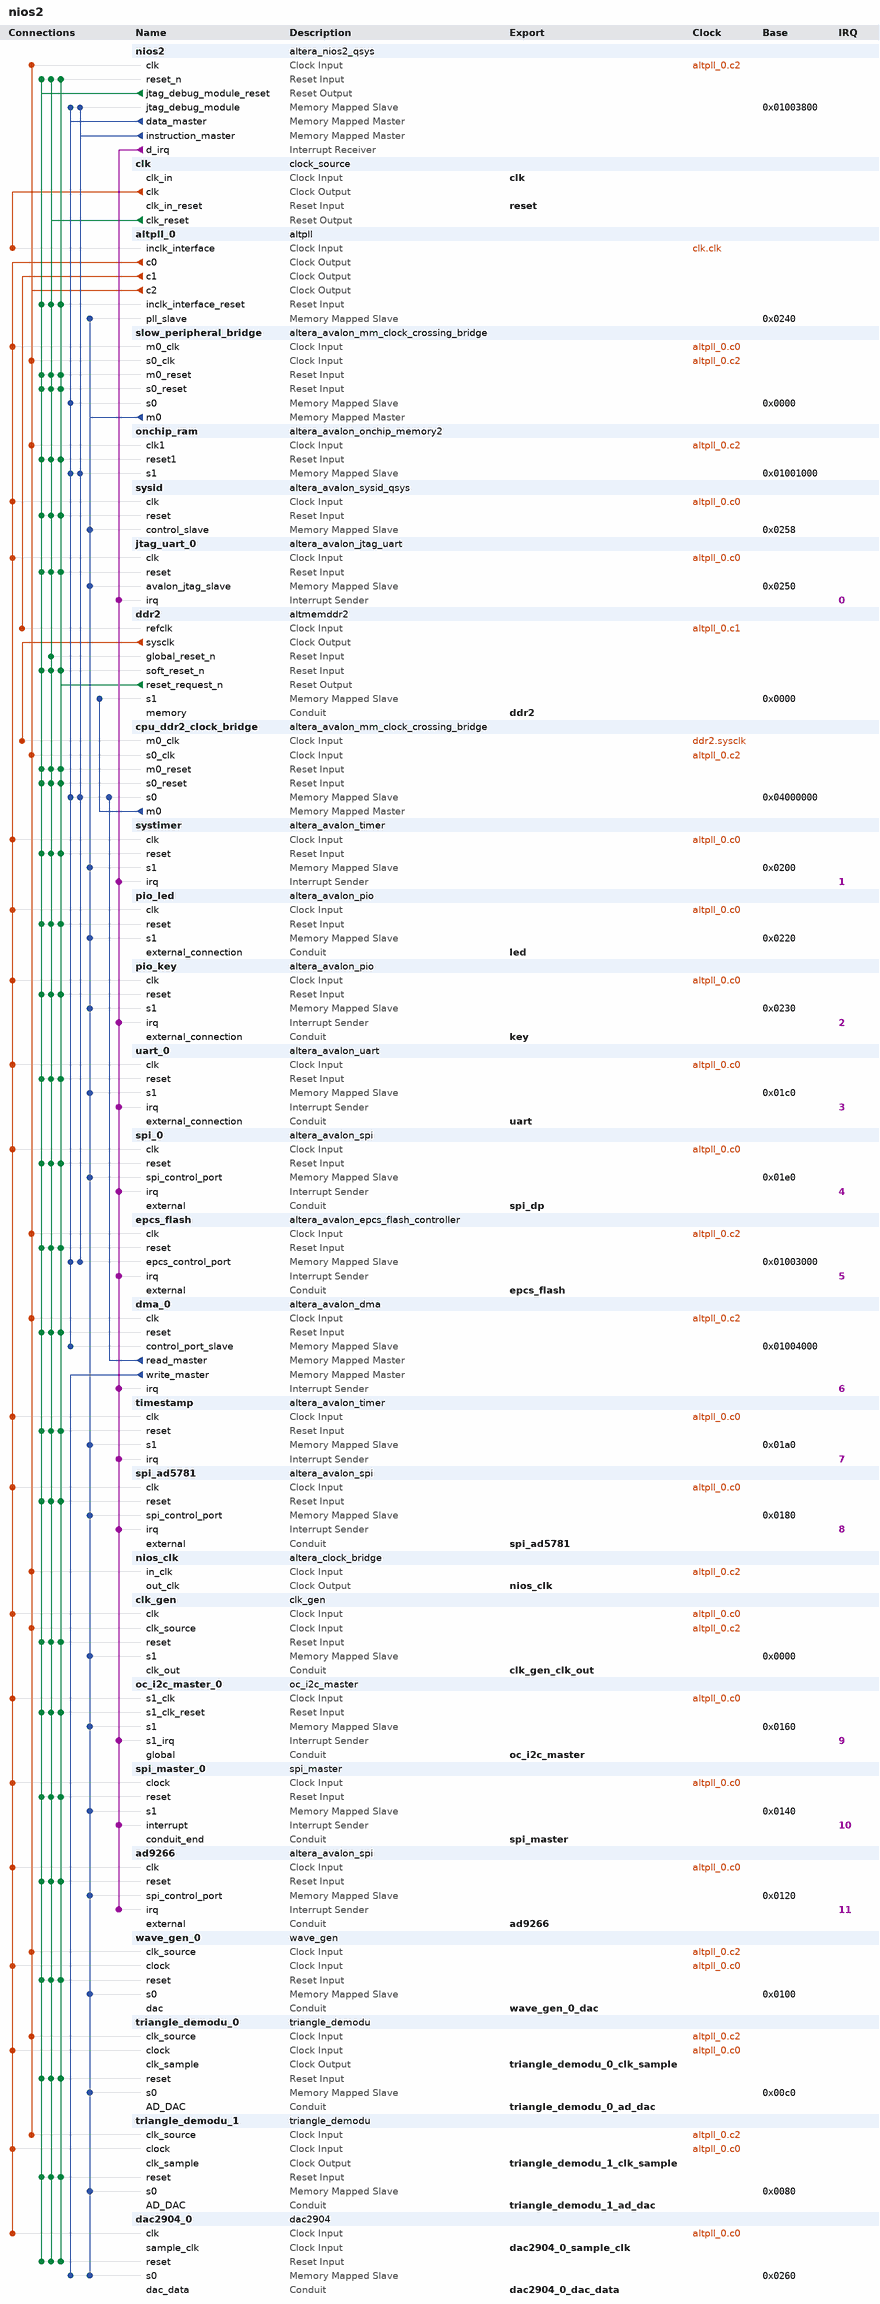
[diagram p0: system contents]
# Platform Designer (Qsys) system nios2, Cyclone IV E EP4CE115F29C8
# Parameters at their usual value, and those the tool derives, are not listed.
package require -exact qsys 13.0.1
create_system nios2
set_project_property DEVICE_FAMILY {Cyclone IV E}
set_project_property DEVICE EP4CE115F29C8

add_instance nios2 altera_nios2_qsys 13.0
set_instance_parameter_value nios2 muldiv_divider true
set_instance_parameter_value nios2 cpuID 858857849
set_instance_parameter_value nios2 resetSlave ddr2.s1
set_instance_parameter_value nios2 mmu_TLBMissExcSlave None
set_instance_parameter_value nios2 exceptionSlave ddr2.s1
set_instance_parameter_value nios2 breakSlave nios2.jtag_debug_module
set_instance_parameter_value nios2 impl Fast
set_instance_parameter_value nios2 icache_size 4096
set_instance_parameter_value nios2 icache_burstType Sequential
set_instance_parameter_value nios2 dcache_bursts true
set_instance_parameter_value nios2 debug_level Level2

add_instance clk clock_source 13.0
set_instance_parameter_value clk clockFrequency 27000000

add_instance altpll_0 altpll 13.0
set_instance_parameter_value altpll_0 INCLK0_INPUT_FREQUENCY 37037
set_instance_parameter_value altpll_0 CLK0_MULTIPLY_BY 2
set_instance_parameter_value altpll_0 CLK1_MULTIPLY_BY 3
set_instance_parameter_value altpll_0 CLK2_MULTIPLY_BY 4
set_instance_parameter_value altpll_0 CLK3_MULTIPLY_BY 3
set_instance_parameter_value altpll_0 CLK0_DIVIDE_BY 1
set_instance_parameter_value altpll_0 CLK1_DIVIDE_BY 1
set_instance_parameter_value altpll_0 CLK2_DIVIDE_BY 1
set_instance_parameter_value altpll_0 CLK3_DIVIDE_BY 1
set_instance_parameter_value altpll_0 CLK1_PHASE_SHIFT 0
set_instance_parameter_value altpll_0 CLK2_PHASE_SHIFT 0
set_instance_parameter_value altpll_0 CLK3_PHASE_SHIFT 0
set_instance_parameter_value altpll_0 CLK1_DUTY_CYCLE 50
set_instance_parameter_value altpll_0 CLK2_DUTY_CYCLE 50
set_instance_parameter_value altpll_0 CLK3_DUTY_CYCLE 50
set_instance_parameter_value altpll_0 PORT_clk1 PORT_USED
set_instance_parameter_value altpll_0 PORT_clk2 PORT_USED
set_instance_parameter_value altpll_0 PORT_clk3 PORT_UNUSED
set_instance_parameter_value altpll_0 PORT_ARESET PORT_UNUSED
set_instance_parameter_value altpll_0 PORT_LOCKED PORT_UNUSED

add_instance slow_peripheral_bridge altera_avalon_mm_clock_crossing_bridge 13.0
set_instance_parameter_value slow_peripheral_bridge DATA_WIDTH 32
set_instance_parameter_value slow_peripheral_bridge ADDRESS_WIDTH 10
set_instance_parameter_value slow_peripheral_bridge MAX_BURST_SIZE 1
set_instance_parameter_value slow_peripheral_bridge COMMAND_FIFO_DEPTH 16
set_instance_parameter_value slow_peripheral_bridge RESPONSE_FIFO_DEPTH 64
set_instance_parameter_value slow_peripheral_bridge MASTER_SYNC_DEPTH 3
set_instance_parameter_value slow_peripheral_bridge SLAVE_SYNC_DEPTH 3

add_instance onchip_ram altera_avalon_onchip_memory2 13.0.1
set_instance_parameter_value onchip_ram dataWidth 32
set_instance_parameter_value onchip_ram dualPort false
set_instance_parameter_value onchip_ram initMemContent true
set_instance_parameter_value onchip_ram initializationFileName onchip_mem.hex
set_instance_parameter_value onchip_ram memorySize 4096

add_instance sysid altera_avalon_sysid_qsys 13.0
set_instance_parameter_value sysid id 0

add_instance jtag_uart_0 altera_avalon_jtag_uart 13.0.1
set_instance_parameter_value jtag_uart_0 simInteractiveOptions NO_INTERACTIVE_WINDOWS

add_instance ddr2 altmemddr2 13.0
set_instance_parameter_value ddr2 pipeline_commands true
set_instance_parameter_value ddr2 debug_en false
set_instance_parameter_value ddr2 export_debug_port false
set_instance_parameter_value ddr2 use_generated_memory_model true
set_instance_parameter_value ddr2 dedicated_memory_clk_phase_label {Dedicated memory clock phase:}
set_instance_parameter_value ddr2 mem_if_clk_mhz 162.0
set_instance_parameter_value ddr2 quartus_project_exists false
set_instance_parameter_value ddr2 local_if_drate Full
set_instance_parameter_value ddr2 enable_v72_rsu false
set_instance_parameter_value ddr2 local_if_clk_mhz_label 162.0
set_instance_parameter_value ddr2 new_variant true
set_instance_parameter_value ddr2 mem_if_memtype {DDR2 SDRAM}
set_instance_parameter_value ddr2 pll_ref_clk_mhz 81.0
set_instance_parameter_value ddr2 mem_if_clk_ps_label {(6173 ps)}
set_instance_parameter_value ddr2 family {Cyclone IV E}
set_instance_parameter_value ddr2 project_family {Cyclone IV E}
set_instance_parameter_value ddr2 speed_grade 8
set_instance_parameter_value ddr2 dedicated_memory_clk_phase 0
set_instance_parameter_value ddr2 pll_ref_clk_ps_label {(12346 ps)}
set_instance_parameter_value ddr2 avalon_burst_length 1
set_instance_parameter_value ddr2 mem_if_clk_pair_count 1
set_instance_parameter_value ddr2 mem_if_cs_per_dimm 1
set_instance_parameter_value ddr2 pre_latency_label {Fix read latency at:}
set_instance_parameter_value ddr2 dedicated_memory_clk_en false
set_instance_parameter_value ddr2 mirror_addressing 0
set_instance_parameter_value ddr2 mem_if_bankaddr_width 2
set_instance_parameter_value ddr2 register_control_word_9 0000
set_instance_parameter_value ddr2 mem_if_rowaddr_width 13
set_instance_parameter_value ddr2 mem_dyn_deskew_en false
set_instance_parameter_value ddr2 post_latency_label {cycles (0 cycles=minimum latency, non-deterministic)}
set_instance_parameter_value ddr2 mem_if_dm_pins_en Yes
set_instance_parameter_value ddr2 local_if_dwidth_label 32
set_instance_parameter_value ddr2 register_control_word_7 0000
set_instance_parameter_value ddr2 register_control_word_8 0000
set_instance_parameter_value ddr2 mem_if_preset {Samsung K4T51163QB-GCCC}
set_instance_parameter_value ddr2 mem_if_pchaddr_bit 10
set_instance_parameter_value ddr2 WIDTH_RATIO 4
set_instance_parameter_value ddr2 vendor Samsung
set_instance_parameter_value ddr2 register_control_word_3 0000
set_instance_parameter_value ddr2 register_control_word_4 0000
set_instance_parameter_value ddr2 chip_or_dimm {Discrete Device}
set_instance_parameter_value ddr2 register_control_word_5 0000
set_instance_parameter_value ddr2 register_control_word_6 0000
set_instance_parameter_value ddr2 mem_fmax 200.0
set_instance_parameter_value ddr2 register_control_word_0 0000
set_instance_parameter_value ddr2 register_control_word_size 4
set_instance_parameter_value ddr2 register_control_word_1 0000
set_instance_parameter_value ddr2 register_control_word_2 0000
set_instance_parameter_value ddr2 register_control_word_11 0000
set_instance_parameter_value ddr2 register_control_word_10 0000
set_instance_parameter_value ddr2 mem_if_cs_width 1
set_instance_parameter_value ddr2 mem_if_preset_rlat 0
set_instance_parameter_value ddr2 mem_if_cs_per_rank 1
set_instance_parameter_value ddr2 fast_simulation_en FAST
set_instance_parameter_value ddr2 register_control_word_15 0000
set_instance_parameter_value ddr2 register_control_word_14 0000
set_instance_parameter_value ddr2 mem_if_dwidth 16
set_instance_parameter_value ddr2 mem_if_dq_per_dqs 8
set_instance_parameter_value ddr2 mem_if_coladdr_width 10
set_instance_parameter_value ddr2 register_control_word_13 0000
set_instance_parameter_value ddr2 register_control_word_12 0000
set_instance_parameter_value ddr2 mem_tiha_ps 600
set_instance_parameter_value ddr2 mem_tdsh_ck 0.2
set_instance_parameter_value ddr2 mem_if_trfc_ns 105.0
set_instance_parameter_value ddr2 mem_tqh_ck 0.36
set_instance_parameter_value ddr2 mem_tisa_ps 600
set_instance_parameter_value ddr2 mem_tdss_ck 0.2
set_instance_parameter_value ddr2 mem_trtp_ns 7.5
set_instance_parameter_value ddr2 mem_if_tinit_us 200.0
set_instance_parameter_value ddr2 mem_if_trcd_ns 15.0
set_instance_parameter_value ddr2 mem_if_twtr_ck 2
set_instance_parameter_value ddr2 mem_trrd_ns 10.0
set_instance_parameter_value ddr2 mem_tdqss_ck 0.25
set_instance_parameter_value ddr2 mem_tqhs_ps 400
set_instance_parameter_value ddr2 mem_tdsa_ps 400
set_instance_parameter_value ddr2 mem_tac_ps 500
set_instance_parameter_value ddr2 mem_tdha_ps 400
set_instance_parameter_value ddr2 mem_if_tras_ns 45.0
set_instance_parameter_value ddr2 mem_if_twr_ns 15.0
set_instance_parameter_value ddr2 mem_tdqsck_ps 450
set_instance_parameter_value ddr2 mem_if_trp_ns 15.0
set_instance_parameter_value ddr2 mem_tdqsq_ps 300
set_instance_parameter_value ddr2 mem_if_tmrd_ns 7.0
set_instance_parameter_value ddr2 mem_tfaw_ns 50.0
set_instance_parameter_value ddr2 mem_if_trefi_us 7.0
set_instance_parameter_value ddr2 mem_tcl_40_fmax 200.0
set_instance_parameter_value ddr2 mem_odt 50
set_instance_parameter_value ddr2 mp_WLH_percent 0.6
set_instance_parameter_value ddr2 mem_drv_str Normal
set_instance_parameter_value ddr2 mp_DH_percent 0.5
set_instance_parameter_value ddr2 input_period 0
set_instance_parameter_value ddr2 mp_QH_percent 0.5
set_instance_parameter_value ddr2 mp_QHS_percent 0.5
set_instance_parameter_value ddr2 mem_tcl_30_fmax 200.0
set_instance_parameter_value ddr2 ac_clk_select 90
set_instance_parameter_value ddr2 mp_DQSQ_percent 0.65
set_instance_parameter_value ddr2 mp_DS_percent 0.6
set_instance_parameter_value ddr2 pll_reconfig_ports_en false
set_instance_parameter_value ddr2 mem_btype Sequential
set_instance_parameter_value ddr2 mp_IS_percent 0.7
set_instance_parameter_value ddr2 mem_tcl 3.0
set_instance_parameter_value ddr2 mp_DQSS_percent 0.5
set_instance_parameter_value ddr2 export_bank_info false
set_instance_parameter_value ddr2 mp_DSS_percent 0.6
set_instance_parameter_value ddr2 mem_dll_en Yes
set_instance_parameter_value ddr2 ac_phase 90
set_instance_parameter_value ddr2 mem_if_oct_en false
set_instance_parameter_value ddr2 mem_tcl_60_fmax 200.0
set_instance_parameter_value ddr2 mp_DSH_percent 0.6
set_instance_parameter_value ddr2 mem_if_dqsn_en false
set_instance_parameter_value ddr2 enable_mp_calibration true
set_instance_parameter_value ddr2 mp_IH_percent 0.6
set_instance_parameter_value ddr2 mem_tcl_15_fmax 533.0
set_instance_parameter_value ddr2 dll_external false
set_instance_parameter_value ddr2 mem_bl 4
set_instance_parameter_value ddr2 mp_WLS_percent 0.7
set_instance_parameter_value ddr2 mem_tcl_50_fmax 200.0
set_instance_parameter_value ddr2 mp_DQSCK_percent 0.5
set_instance_parameter_value ddr2 mem_tcl_25_fmax 533.0
set_instance_parameter_value ddr2 mem_tcl_20_fmax 533.0
set_instance_parameter_value ddr2 cfg_reorder_data true
set_instance_parameter_value ddr2 ctl_ecc_en false
set_instance_parameter_value ddr2 ctl_hrb_en false
set_instance_parameter_value ddr2 ref_clk_source altpll_0
set_instance_parameter_value ddr2 cfg_data_reordering_type INTER_BANK
set_instance_parameter_value ddr2 ctl_powerdn_en false
set_instance_parameter_value ddr2 multicast_wr_en false
set_instance_parameter_value ddr2 auto_powerdn_cycles 0
set_instance_parameter_value ddr2 ctl_self_refresh_en true
set_instance_parameter_value ddr2 cfg_starve_limit 10
set_instance_parameter_value ddr2 ctl_latency 0
set_instance_parameter_value ddr2 tool_context SOPC_BUILDER
set_instance_parameter_value ddr2 mem_addr_mapping CHIP_ROW_BANK_COL
set_instance_parameter_value ddr2 burst_merge_en false
set_instance_parameter_value ddr2 user_refresh_en false
set_instance_parameter_value ddr2 qsys_mode true
set_instance_parameter_value ddr2 clk_source_sharing_en false
set_instance_parameter_value ddr2 ctl_lookahead_depth 4
set_instance_parameter_value ddr2 ctl_autopch_en false
set_instance_parameter_value ddr2 ctl_dynamic_bank_allocation false
set_instance_parameter_value ddr2 ctl_dynamic_bank_num 4
set_instance_parameter_value ddr2 local_if_type_avalon true
set_instance_parameter_value ddr2 csr_en false
set_instance_parameter_value ddr2 ctl_auto_correct_en false
set_instance_parameter_value ddr2 auto_powerdn_en false
set_instance_parameter_value ddr2 phy_if_type_afi true
set_instance_parameter_value ddr2 controller_type ngv110_ctl
set_instance_parameter_value ddr2 max_local_size 4
set_instance_parameter_value ddr2 mem_srtr Normal
set_instance_parameter_value ddr2 mem_mpr_loc {Predefined Pattern}
set_instance_parameter_value ddr2 dss_tinit_rst_us 200.0
set_instance_parameter_value ddr2 mem_tcl_90_fmax 400.0
set_instance_parameter_value ddr2 mem_rtt_wr {Dynamic ODT off}
set_instance_parameter_value ddr2 mem_tcl_100_fmax 400.0
set_instance_parameter_value ddr2 mem_pasr {Full Array}
set_instance_parameter_value ddr2 mem_asrm {Manual SR Reference (SRT)}
set_instance_parameter_value ddr2 mem_mpr_oper {Predefined Pattern}
set_instance_parameter_value ddr2 mem_tcl_80_fmax 400.0
set_instance_parameter_value ddr2 mem_drv_impedance RZQ/7
set_instance_parameter_value ddr2 mem_rtt_nom {ODT Disabled}
set_instance_parameter_value ddr2 mem_tcl_70_fmax 400.0
set_instance_parameter_value ddr2 mem_wtcl 5.0
set_instance_parameter_value ddr2 mem_dll_pch {Fast Exit}
set_instance_parameter_value ddr2 mem_atcl Disabled
set_instance_parameter_value ddr2 board_settings_valid true
set_instance_parameter_value ddr2 t_IH 0.6
set_instance_parameter_value ddr2 board_intra_DQS_group_skew 0.02
set_instance_parameter_value ddr2 isi_DQS 0.0
set_instance_parameter_value ddr2 addr_cmd_slew_rate 1.0
set_instance_parameter_value ddr2 board_tpd_inter_DIMM 0.05
set_instance_parameter_value ddr2 board_addresscmd_CK_skew 0.0
set_instance_parameter_value ddr2 t_DS_calculated 0.400
set_instance_parameter_value ddr2 isi_addresscmd_hold 0.0
set_instance_parameter_value ddr2 t_IS 0.6
set_instance_parameter_value ddr2 restore_default_toggle true
set_instance_parameter_value ddr2 dqs_dqsn_slew_rate 2.0
set_instance_parameter_value ddr2 dq_slew_rate 1.0
set_instance_parameter_value ddr2 board_inter_DQS_group_skew 0.02
set_instance_parameter_value ddr2 isi_addresscmd_setup 0.0
set_instance_parameter_value ddr2 board_minCK_DQS_skew -0.01
set_instance_parameter_value ddr2 t_IS_calculated 0.600
set_instance_parameter_value ddr2 num_slots_or_devices 1
set_instance_parameter_value ddr2 board_maxCK_DQS_skew 0.01
set_instance_parameter_value ddr2 board_skew_ps 20
set_instance_parameter_value ddr2 t_DH 0.4
set_instance_parameter_value ddr2 ck_ckn_slew_rate 2.0
set_instance_parameter_value ddr2 isi_DQ 0.0
set_instance_parameter_value ddr2 t_IH_calculated 0.600
set_instance_parameter_value ddr2 t_DH_calculated 0.400
set_instance_parameter_value ddr2 t_DS 0.4

add_instance cpu_ddr2_clock_bridge altera_avalon_mm_clock_crossing_bridge 13.0
set_instance_parameter_value cpu_ddr2_clock_bridge DATA_WIDTH 32
set_instance_parameter_value cpu_ddr2_clock_bridge ADDRESS_WIDTH 26
set_instance_parameter_value cpu_ddr2_clock_bridge MAX_BURST_SIZE 1
set_instance_parameter_value cpu_ddr2_clock_bridge COMMAND_FIFO_DEPTH 8
set_instance_parameter_value cpu_ddr2_clock_bridge RESPONSE_FIFO_DEPTH 64
set_instance_parameter_value cpu_ddr2_clock_bridge MASTER_SYNC_DEPTH 3
set_instance_parameter_value cpu_ddr2_clock_bridge SLAVE_SYNC_DEPTH 3

add_instance systimer altera_avalon_timer 13.0.1
set_instance_parameter_value systimer period 10
set_instance_parameter_value systimer periodUnits MSEC

add_instance pio_led altera_avalon_pio 13.0.1
set_instance_parameter_value pio_led direction Output
set_instance_parameter_value pio_led width 6

add_instance pio_key altera_avalon_pio 13.0.1
set_instance_parameter_value pio_key captureEdge true
set_instance_parameter_value pio_key direction Input
set_instance_parameter_value pio_key edgeType FALLING
set_instance_parameter_value pio_key generateIRQ true
set_instance_parameter_value pio_key irqType EDGE
set_instance_parameter_value pio_key width 4

add_instance uart_0 altera_avalon_uart 13.0.1
set_instance_parameter_value uart_0 baud 115200
set_instance_parameter_value uart_0 dataBits 8
set_instance_parameter_value uart_0 fixedBaud true
set_instance_parameter_value uart_0 parity NONE
set_instance_parameter_value uart_0 stopBits 1

add_instance spi_0 altera_avalon_spi 13.0.1
set_instance_parameter_value spi_0 clockPolarity 1
set_instance_parameter_value spi_0 dataWidth 8
set_instance_parameter_value spi_0 masterSPI true
set_instance_parameter_value spi_0 numberOfSlaves 1
set_instance_parameter_value spi_0 targetClockRate 1000000

add_instance epcs_flash altera_avalon_epcs_flash_controller 13.0.1

add_instance dma_0 altera_avalon_dma 13.0.1
set_instance_parameter_value dma_0 allowByteTransactions true
set_instance_parameter_value dma_0 allowDoubleWordTransactions true
set_instance_parameter_value dma_0 allowHalfWordTransactions true
set_instance_parameter_value dma_0 allowQuadWordTransactions true
set_instance_parameter_value dma_0 burstEnable false
set_instance_parameter_value dma_0 fifoDepth 1024
set_instance_parameter_value dma_0 maxBurstSize 128
set_instance_parameter_value dma_0 minimumDmaTransactionRegisterWidth 32

add_instance timestamp altera_avalon_timer 13.0.1
set_instance_parameter_value timestamp period 1
set_instance_parameter_value timestamp periodUnits USEC

add_instance spi_ad5781 altera_avalon_spi 13.0.1
set_instance_parameter_value spi_ad5781 clockPolarity 1
set_instance_parameter_value spi_ad5781 dataWidth 8
set_instance_parameter_value spi_ad5781 masterSPI true
set_instance_parameter_value spi_ad5781 numberOfSlaves 1
set_instance_parameter_value spi_ad5781 targetClockRate 27000000

add_instance nios_clk altera_clock_bridge 13.0
set_instance_parameter_value nios_clk DERIVED_CLOCK_RATE 108000000
set_instance_parameter_value nios_clk EXPLICIT_CLOCK_RATE 108000000

add_instance clk_gen clk_gen 2.0
set_instance_parameter_value clk_gen clk_num 8

add_instance oc_i2c_master_0 oc_i2c_master 2.1.1

add_instance spi_master_0 spi_master 1.0
set_instance_parameter_value spi_master_0 numberOfSlaves 1
set_instance_parameter_value spi_master_0 clk_pol 1
set_instance_parameter_value spi_master_0 clk_pha 0

add_instance ad9266 altera_avalon_spi 13.0.1
set_instance_parameter_value ad9266 clockPhase 1
set_instance_parameter_value ad9266 clockPolarity 1
set_instance_parameter_value ad9266 dataWidth 8
set_instance_parameter_value ad9266 masterSPI true
set_instance_parameter_value ad9266 numberOfSlaves 1
set_instance_parameter_value ad9266 targetClockRate 2000000

add_instance wave_gen_0 wave_gen 1.0
set_instance_parameter_value wave_gen_0 AmpMax 16383
set_instance_parameter_value wave_gen_0 AmpMin 0
set_instance_parameter_value wave_gen_0 FreqDiv 20
set_instance_parameter_value wave_gen_0 SamplePonint 256

add_instance triangle_demodu_0 triangle_demodu 1.0
set_instance_parameter_value triangle_demodu_0 AmpMax 16383
set_instance_parameter_value triangle_demodu_0 AmpMin 0
set_instance_parameter_value triangle_demodu_0 FreqDiv 20
set_instance_parameter_value triangle_demodu_0 SamplePonint 256
set_instance_parameter_value triangle_demodu_0 Sample1Start 32
set_instance_parameter_value triangle_demodu_0 Sample2Start 128
set_instance_parameter_value triangle_demodu_0 Sample1Num 32
set_instance_parameter_value triangle_demodu_0 Sample2Num 32

add_instance triangle_demodu_1 triangle_demodu 1.0
set_instance_parameter_value triangle_demodu_1 AmpMax 16383
set_instance_parameter_value triangle_demodu_1 AmpMin 0
set_instance_parameter_value triangle_demodu_1 FreqDiv 20
set_instance_parameter_value triangle_demodu_1 SamplePonint 256
set_instance_parameter_value triangle_demodu_1 Sample1Start 32
set_instance_parameter_value triangle_demodu_1 Sample2Start 128
set_instance_parameter_value triangle_demodu_1 Sample1Num 32
set_instance_parameter_value triangle_demodu_1 Sample2Num 32

add_instance dac2904_0 dac2904 3.0

# connections
add_connection altpll_0.c0 ad9266.clk clock
add_connection altpll_0.c0 clk_gen.clk clock
add_connection altpll_0.c0 dac2904_0.clk clock
add_connection altpll_0.c0 jtag_uart_0.clk clock
add_connection altpll_0.c0 oc_i2c_master_0.s1_clk clock
add_connection altpll_0.c0 pio_key.clk clock
add_connection altpll_0.c0 pio_led.clk clock
add_connection altpll_0.c0 slow_peripheral_bridge.m0_clk clock
add_connection altpll_0.c0 spi_0.clk clock
add_connection altpll_0.c0 spi_ad5781.clk clock
add_connection altpll_0.c0 spi_master_0.clock clock
add_connection altpll_0.c0 sysid.clk clock
add_connection altpll_0.c0 systimer.clk clock
add_connection altpll_0.c0 timestamp.clk clock
add_connection altpll_0.c0 triangle_demodu_0.clock clock
add_connection altpll_0.c0 triangle_demodu_1.clock clock
add_connection altpll_0.c0 uart_0.clk clock
add_connection altpll_0.c0 wave_gen_0.clock clock
add_connection altpll_0.c1 ddr2.refclk clock
add_connection altpll_0.c2 clk_gen.clk_source clock
add_connection altpll_0.c2 cpu_ddr2_clock_bridge.s0_clk clock
add_connection altpll_0.c2 dma_0.clk clock
add_connection altpll_0.c2 epcs_flash.clk clock
add_connection altpll_0.c2 nios2.clk clock
add_connection altpll_0.c2 nios_clk.in_clk clock
add_connection altpll_0.c2 onchip_ram.clk1 clock
add_connection altpll_0.c2 slow_peripheral_bridge.s0_clk clock
add_connection altpll_0.c2 triangle_demodu_0.clk_source clock
add_connection altpll_0.c2 triangle_demodu_1.clk_source clock
add_connection altpll_0.c2 wave_gen_0.clk_source clock
add_connection clk.clk altpll_0.inclk_interface clock
add_connection ddr2.sysclk cpu_ddr2_clock_bridge.m0_clk clock
add_connection clk.clk_reset ad9266.reset reset
add_connection clk.clk_reset altpll_0.inclk_interface_reset reset
add_connection clk.clk_reset clk_gen.reset reset
add_connection clk.clk_reset cpu_ddr2_clock_bridge.m0_reset reset
add_connection clk.clk_reset cpu_ddr2_clock_bridge.s0_reset reset
add_connection clk.clk_reset dac2904_0.reset reset
add_connection clk.clk_reset ddr2.global_reset_n reset
add_connection clk.clk_reset ddr2.soft_reset_n reset
add_connection clk.clk_reset dma_0.reset reset
add_connection clk.clk_reset epcs_flash.reset reset
add_connection clk.clk_reset jtag_uart_0.reset reset
add_connection clk.clk_reset nios2.reset_n reset
add_connection clk.clk_reset oc_i2c_master_0.s1_clk_reset reset
add_connection clk.clk_reset onchip_ram.reset1 reset
add_connection clk.clk_reset pio_key.reset reset
add_connection clk.clk_reset pio_led.reset reset
add_connection clk.clk_reset slow_peripheral_bridge.m0_reset reset
add_connection clk.clk_reset slow_peripheral_bridge.s0_reset reset
add_connection clk.clk_reset spi_0.reset reset
add_connection clk.clk_reset spi_ad5781.reset reset
add_connection clk.clk_reset spi_master_0.reset reset
add_connection clk.clk_reset sysid.reset reset
add_connection clk.clk_reset systimer.reset reset
add_connection clk.clk_reset timestamp.reset reset
add_connection clk.clk_reset triangle_demodu_0.reset reset
add_connection clk.clk_reset triangle_demodu_1.reset reset
add_connection clk.clk_reset uart_0.reset reset
add_connection clk.clk_reset wave_gen_0.reset reset
add_connection ddr2.reset_request_n ad9266.reset reset
add_connection ddr2.reset_request_n altpll_0.inclk_interface_reset reset
add_connection ddr2.reset_request_n clk_gen.reset reset
add_connection ddr2.reset_request_n cpu_ddr2_clock_bridge.m0_reset reset
add_connection ddr2.reset_request_n cpu_ddr2_clock_bridge.s0_reset reset
add_connection ddr2.reset_request_n dac2904_0.reset reset
add_connection ddr2.reset_request_n ddr2.soft_reset_n reset
add_connection ddr2.reset_request_n dma_0.reset reset
add_connection ddr2.reset_request_n epcs_flash.reset reset
add_connection ddr2.reset_request_n jtag_uart_0.reset reset
add_connection ddr2.reset_request_n nios2.reset_n reset
add_connection ddr2.reset_request_n oc_i2c_master_0.s1_clk_reset reset
add_connection ddr2.reset_request_n onchip_ram.reset1 reset
add_connection ddr2.reset_request_n pio_key.reset reset
add_connection ddr2.reset_request_n pio_led.reset reset
add_connection ddr2.reset_request_n slow_peripheral_bridge.m0_reset reset
add_connection ddr2.reset_request_n slow_peripheral_bridge.s0_reset reset
add_connection ddr2.reset_request_n spi_0.reset reset
add_connection ddr2.reset_request_n spi_ad5781.reset reset
add_connection ddr2.reset_request_n spi_master_0.reset reset
add_connection ddr2.reset_request_n sysid.reset reset
add_connection ddr2.reset_request_n systimer.reset reset
add_connection ddr2.reset_request_n timestamp.reset reset
add_connection ddr2.reset_request_n triangle_demodu_0.reset reset
add_connection ddr2.reset_request_n triangle_demodu_1.reset reset
add_connection ddr2.reset_request_n uart_0.reset reset
add_connection ddr2.reset_request_n wave_gen_0.reset reset
add_connection nios2.jtag_debug_module_reset ad9266.reset reset
add_connection nios2.jtag_debug_module_reset altpll_0.inclk_interface_reset reset
add_connection nios2.jtag_debug_module_reset clk_gen.reset reset
add_connection nios2.jtag_debug_module_reset cpu_ddr2_clock_bridge.m0_reset reset
add_connection nios2.jtag_debug_module_reset cpu_ddr2_clock_bridge.s0_reset reset
add_connection nios2.jtag_debug_module_reset dac2904_0.reset reset
add_connection nios2.jtag_debug_module_reset ddr2.soft_reset_n reset
add_connection nios2.jtag_debug_module_reset dma_0.reset reset
add_connection nios2.jtag_debug_module_reset epcs_flash.reset reset
add_connection nios2.jtag_debug_module_reset jtag_uart_0.reset reset
add_connection nios2.jtag_debug_module_reset nios2.reset_n reset
add_connection nios2.jtag_debug_module_reset oc_i2c_master_0.s1_clk_reset reset
add_connection nios2.jtag_debug_module_reset onchip_ram.reset1 reset
add_connection nios2.jtag_debug_module_reset pio_key.reset reset
add_connection nios2.jtag_debug_module_reset pio_led.reset reset
add_connection nios2.jtag_debug_module_reset slow_peripheral_bridge.m0_reset reset
add_connection nios2.jtag_debug_module_reset slow_peripheral_bridge.s0_reset reset
add_connection nios2.jtag_debug_module_reset spi_0.reset reset
add_connection nios2.jtag_debug_module_reset spi_ad5781.reset reset
add_connection nios2.jtag_debug_module_reset spi_master_0.reset reset
add_connection nios2.jtag_debug_module_reset sysid.reset reset
add_connection nios2.jtag_debug_module_reset systimer.reset reset
add_connection nios2.jtag_debug_module_reset timestamp.reset reset
add_connection nios2.jtag_debug_module_reset triangle_demodu_0.reset reset
add_connection nios2.jtag_debug_module_reset triangle_demodu_1.reset reset
add_connection nios2.jtag_debug_module_reset uart_0.reset reset
add_connection nios2.jtag_debug_module_reset wave_gen_0.reset reset
add_connection cpu_ddr2_clock_bridge.m0 ddr2.s1 avalon
set_connection_parameter_value cpu_ddr2_clock_bridge.m0/ddr2.s1 baseAddress 0x0000
add_connection dma_0.read_master cpu_ddr2_clock_bridge.s0 avalon
set_connection_parameter_value dma_0.read_master/cpu_ddr2_clock_bridge.s0 baseAddress 0x04000000
add_connection dma_0.write_master dac2904_0.s0 avalon
set_connection_parameter_value dma_0.write_master/dac2904_0.s0 baseAddress 0x0260
add_connection nios2.data_master cpu_ddr2_clock_bridge.s0 avalon
set_connection_parameter_value nios2.data_master/cpu_ddr2_clock_bridge.s0 baseAddress 0x04000000
add_connection nios2.data_master dma_0.control_port_slave avalon
set_connection_parameter_value nios2.data_master/dma_0.control_port_slave baseAddress 0x01004000
add_connection nios2.data_master epcs_flash.epcs_control_port avalon
set_connection_parameter_value nios2.data_master/epcs_flash.epcs_control_port baseAddress 0x01003000
add_connection nios2.data_master nios2.jtag_debug_module avalon
set_connection_parameter_value nios2.data_master/nios2.jtag_debug_module baseAddress 0x01003800
add_connection nios2.data_master onchip_ram.s1 avalon
set_connection_parameter_value nios2.data_master/onchip_ram.s1 baseAddress 0x01001000
add_connection nios2.data_master slow_peripheral_bridge.s0 avalon
set_connection_parameter_value nios2.data_master/slow_peripheral_bridge.s0 baseAddress 0x0000
add_connection nios2.instruction_master cpu_ddr2_clock_bridge.s0 avalon
set_connection_parameter_value nios2.instruction_master/cpu_ddr2_clock_bridge.s0 baseAddress 0x04000000
add_connection nios2.instruction_master epcs_flash.epcs_control_port avalon
set_connection_parameter_value nios2.instruction_master/epcs_flash.epcs_control_port baseAddress 0x01003000
add_connection nios2.instruction_master nios2.jtag_debug_module avalon
set_connection_parameter_value nios2.instruction_master/nios2.jtag_debug_module baseAddress 0x01003800
add_connection nios2.instruction_master onchip_ram.s1 avalon
set_connection_parameter_value nios2.instruction_master/onchip_ram.s1 baseAddress 0x01001000
add_connection slow_peripheral_bridge.m0 ad9266.spi_control_port avalon
set_connection_parameter_value slow_peripheral_bridge.m0/ad9266.spi_control_port baseAddress 0x0120
add_connection slow_peripheral_bridge.m0 altpll_0.pll_slave avalon
set_connection_parameter_value slow_peripheral_bridge.m0/altpll_0.pll_slave baseAddress 0x0240
add_connection slow_peripheral_bridge.m0 clk_gen.s1 avalon
set_connection_parameter_value slow_peripheral_bridge.m0/clk_gen.s1 baseAddress 0x0000
add_connection slow_peripheral_bridge.m0 dac2904_0.s0 avalon
set_connection_parameter_value slow_peripheral_bridge.m0/dac2904_0.s0 baseAddress 0x0260
add_connection slow_peripheral_bridge.m0 jtag_uart_0.avalon_jtag_slave avalon
set_connection_parameter_value slow_peripheral_bridge.m0/jtag_uart_0.avalon_jtag_slave baseAddress 0x0250
add_connection slow_peripheral_bridge.m0 oc_i2c_master_0.s1 avalon
set_connection_parameter_value slow_peripheral_bridge.m0/oc_i2c_master_0.s1 baseAddress 0x0160
add_connection slow_peripheral_bridge.m0 pio_key.s1 avalon
set_connection_parameter_value slow_peripheral_bridge.m0/pio_key.s1 baseAddress 0x0230
add_connection slow_peripheral_bridge.m0 pio_led.s1 avalon
set_connection_parameter_value slow_peripheral_bridge.m0/pio_led.s1 baseAddress 0x0220
add_connection slow_peripheral_bridge.m0 spi_0.spi_control_port avalon
set_connection_parameter_value slow_peripheral_bridge.m0/spi_0.spi_control_port baseAddress 0x01e0
add_connection slow_peripheral_bridge.m0 spi_ad5781.spi_control_port avalon
set_connection_parameter_value slow_peripheral_bridge.m0/spi_ad5781.spi_control_port baseAddress 0x0180
add_connection slow_peripheral_bridge.m0 spi_master_0.s1 avalon
set_connection_parameter_value slow_peripheral_bridge.m0/spi_master_0.s1 baseAddress 0x0140
add_connection slow_peripheral_bridge.m0 sysid.control_slave avalon
set_connection_parameter_value slow_peripheral_bridge.m0/sysid.control_slave baseAddress 0x0258
add_connection slow_peripheral_bridge.m0 systimer.s1 avalon
set_connection_parameter_value slow_peripheral_bridge.m0/systimer.s1 baseAddress 0x0200
add_connection slow_peripheral_bridge.m0 timestamp.s1 avalon
set_connection_parameter_value slow_peripheral_bridge.m0/timestamp.s1 baseAddress 0x01a0
add_connection slow_peripheral_bridge.m0 triangle_demodu_0.s0 avalon
set_connection_parameter_value slow_peripheral_bridge.m0/triangle_demodu_0.s0 baseAddress 0x00c0
add_connection slow_peripheral_bridge.m0 triangle_demodu_1.s0 avalon
set_connection_parameter_value slow_peripheral_bridge.m0/triangle_demodu_1.s0 baseAddress 0x0080
add_connection slow_peripheral_bridge.m0 uart_0.s1 avalon
set_connection_parameter_value slow_peripheral_bridge.m0/uart_0.s1 baseAddress 0x01c0
add_connection slow_peripheral_bridge.m0 wave_gen_0.s0 avalon
set_connection_parameter_value slow_peripheral_bridge.m0/wave_gen_0.s0 baseAddress 0x0100
add_connection nios2.d_irq ad9266.irq interrupt
set_connection_parameter_value nios2.d_irq/ad9266.irq irqNumber 11
add_connection nios2.d_irq dma_0.irq interrupt
set_connection_parameter_value nios2.d_irq/dma_0.irq irqNumber 6
add_connection nios2.d_irq epcs_flash.irq interrupt
set_connection_parameter_value nios2.d_irq/epcs_flash.irq irqNumber 5
add_connection nios2.d_irq jtag_uart_0.irq interrupt
set_connection_parameter_value nios2.d_irq/jtag_uart_0.irq irqNumber 0
add_connection nios2.d_irq oc_i2c_master_0.s1_irq interrupt
set_connection_parameter_value nios2.d_irq/oc_i2c_master_0.s1_irq irqNumber 9
add_connection nios2.d_irq pio_key.irq interrupt
set_connection_parameter_value nios2.d_irq/pio_key.irq irqNumber 2
add_connection nios2.d_irq spi_0.irq interrupt
set_connection_parameter_value nios2.d_irq/spi_0.irq irqNumber 4
add_connection nios2.d_irq spi_ad5781.irq interrupt
set_connection_parameter_value nios2.d_irq/spi_ad5781.irq irqNumber 8
add_connection nios2.d_irq spi_master_0.interrupt interrupt
set_connection_parameter_value nios2.d_irq/spi_master_0.interrupt irqNumber 10
add_connection nios2.d_irq systimer.irq interrupt
set_connection_parameter_value nios2.d_irq/systimer.irq irqNumber 1
add_connection nios2.d_irq timestamp.irq interrupt
set_connection_parameter_value nios2.d_irq/timestamp.irq irqNumber 7
add_connection nios2.d_irq uart_0.irq interrupt
set_connection_parameter_value nios2.d_irq/uart_0.irq irqNumber 3

# exported interfaces
add_interface clk clock sink
set_interface_property clk EXPORT_OF clk.clk_in
add_interface reset reset sink
set_interface_property reset EXPORT_OF clk.clk_in_reset
add_interface ddr2 conduit end
set_interface_property ddr2 EXPORT_OF ddr2.memory
add_interface led conduit end
set_interface_property led EXPORT_OF pio_led.external_connection
add_interface key conduit end
set_interface_property key EXPORT_OF pio_key.external_connection
add_interface uart conduit end
set_interface_property uart EXPORT_OF uart_0.external_connection
add_interface spi_dp conduit end
set_interface_property spi_dp EXPORT_OF spi_0.external
add_interface epcs_flash conduit end
set_interface_property epcs_flash EXPORT_OF epcs_flash.external
add_interface spi_ad5781 conduit end
set_interface_property spi_ad5781 EXPORT_OF spi_ad5781.external
add_interface nios_clk clock source
set_interface_property nios_clk EXPORT_OF nios_clk.out_clk
add_interface oc_i2c_master conduit end
set_interface_property oc_i2c_master EXPORT_OF oc_i2c_master_0.global
add_interface spi_master conduit end
set_interface_property spi_master EXPORT_OF spi_master_0.conduit_end
add_interface ad9266 conduit end
set_interface_property ad9266 EXPORT_OF ad9266.external
add_interface clk_gen_clk_out conduit end
set_interface_property clk_gen_clk_out EXPORT_OF clk_gen.clk_out
add_interface wave_gen_0_dac conduit end
set_interface_property wave_gen_0_dac EXPORT_OF wave_gen_0.dac
add_interface triangle_demodu_0_clk_sample clock source
set_interface_property triangle_demodu_0_clk_sample EXPORT_OF triangle_demodu_0.clk_sample
add_interface triangle_demodu_0_ad_dac conduit end
set_interface_property triangle_demodu_0_ad_dac EXPORT_OF triangle_demodu_0.AD_DAC
add_interface triangle_demodu_1_clk_sample clock source
set_interface_property triangle_demodu_1_clk_sample EXPORT_OF triangle_demodu_1.clk_sample
add_interface triangle_demodu_1_ad_dac conduit end
set_interface_property triangle_demodu_1_ad_dac EXPORT_OF triangle_demodu_1.AD_DAC
add_interface dac2904_0_dac_data conduit end
set_interface_property dac2904_0_dac_data EXPORT_OF dac2904_0.dac_data
add_interface dac2904_0_sample_clk clock sink
set_interface_property dac2904_0_sample_clk EXPORT_OF dac2904_0.sample_clk

set_interconnect_requirement {$system} qsys_mm.clockCrossingAdapter HANDSHAKE
set_interconnect_requirement {$system} qsys_mm.maxAdditionalLatency 1

save_system nios2.qsys
